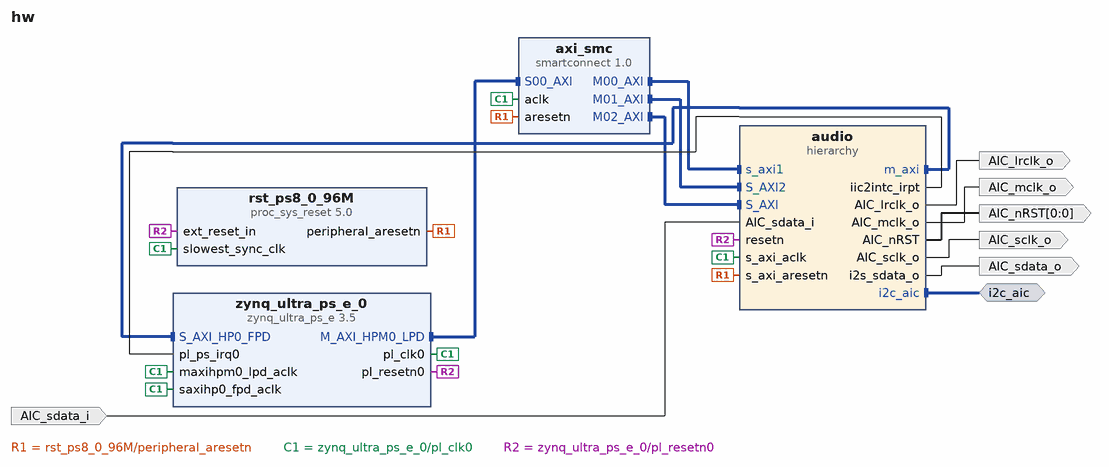
[diagram p0: block diagram of the top level]
# Vivado block design hw, xczu3eg-sfvc784-2-e, Vivado 2025.2
create_bd_design hw

create_bd_intf_port -mode Master -vlnv xilinx.com:interface:iic_rtl:1.0 i2c_aic
create_bd_port -dir O -from 0 -to 0 AIC_nRST
create_bd_port -dir O -type clk AIC_mclk_o
create_bd_port -dir I AIC_sdata_i
create_bd_port -dir O AIC_lrclk_o
create_bd_port -dir O AIC_sclk_o
create_bd_port -dir O AIC_sdata_o

create_bd_cell -type ip -vlnv xilinx.com:ip:zynq_ultra_ps_e:3.5 zynq_ultra_ps_e_0
set_property -dict [list \
  CONFIG.PSU__DDR_HIGH_ADDRESS_GUI_ENABLE 0 \
  CONFIG.PSU__SAXIGP2__DATA_WIDTH 32 \
  CONFIG.PSU__USE__IRQ0 1 \
  CONFIG.PSU__USE__S_AXI_GP2 1 \
] [get_bd_cells zynq_ultra_ps_e_0]
# 5 more settings of zynq_ultra_ps_e_0 are not shown: defaults, MIO pin electricals, DDR timing, and values the tool derives
create_bd_cell -type ip -vlnv xilinx.com:ip:smartconnect:1.0 axi_smc
set_property -dict {CONFIG.NUM_MI 3 CONFIG.NUM_SI 1} [get_bd_cells axi_smc]
create_bd_cell -type ip -vlnv xilinx.com:ip:proc_sys_reset:5.0 rst_ps8_0_96M
create_bd_cell -type hier audio

# ---- hierarchy /audio ----
current_bd_instance /audio
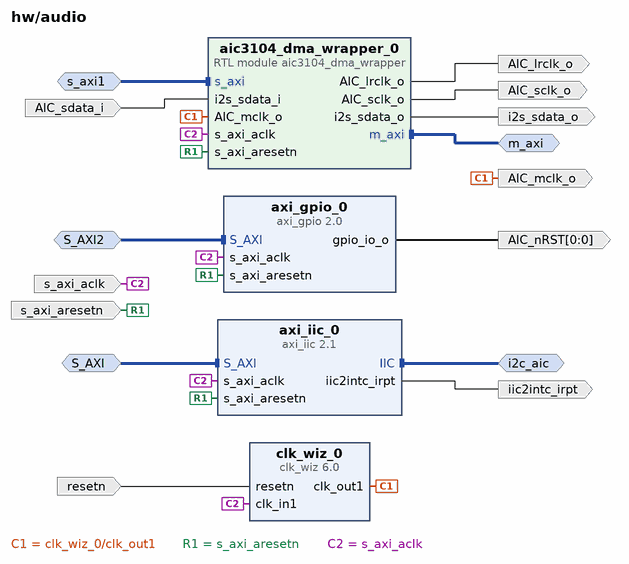
[diagram p1: block diagram inside /audio]
create_bd_intf_pin -mode Slave -vlnv xilinx.com:interface:aximm_rtl:1.0 S_AXI
create_bd_intf_pin -mode Master -vlnv xilinx.com:interface:iic_rtl:1.0 i2c_aic
create_bd_intf_pin -mode Slave -vlnv xilinx.com:interface:aximm_rtl:1.0 s_axi1
create_bd_intf_pin -mode Slave -vlnv xilinx.com:interface:aximm_rtl:1.0 S_AXI2
create_bd_intf_pin -mode Master -vlnv xilinx.com:interface:aximm_rtl:1.0 m_axi
create_bd_pin -dir I -type clk s_axi_aclk
create_bd_pin -dir I -type rst s_axi_aresetn
create_bd_pin -dir O -type intr iic2intc_irpt
create_bd_pin -dir O -type clk AIC_mclk_o
create_bd_pin -dir O AIC_lrclk_o
create_bd_pin -dir O AIC_sclk_o
create_bd_pin -dir I AIC_sdata_i
create_bd_pin -dir O i2s_sdata_o
create_bd_pin -dir O -from 0 -to 0 AIC_nRST
create_bd_pin -dir I -type rst resetn

create_bd_cell -type ip -vlnv xilinx.com:ip:axi_iic:2.1 axi_iic_0
create_bd_cell -type ip -vlnv xilinx.com:ip:axi_gpio:2.0 axi_gpio_0
set_property -dict {CONFIG.C_ALL_OUTPUTS 1 CONFIG.C_GPIO_WIDTH 1} [get_bd_cells axi_gpio_0]
create_bd_cell -type ip -vlnv xilinx.com:ip:clk_wiz:6.0 clk_wiz_0
set_property -dict [list \
  CONFIG.CLKOUT1_JITTER 238.693 \
  CONFIG.CLKOUT1_PHASE_ERROR 160.623 \
  CONFIG.CLKOUT1_REQUESTED_OUT_FREQ 12.288 \
  CONFIG.MMCM_CLKFBOUT_MULT_F 22.875 \
  CONFIG.MMCM_CLKOUT0_DIVIDE_F 90.250 \
  CONFIG.MMCM_DIVCLK_DIVIDE 2 \
  CONFIG.RESET_PORT resetn \
  CONFIG.RESET_TYPE ACTIVE_LOW \
] [get_bd_cells clk_wiz_0]
create_bd_cell -type module -reference aic3104_dma_wrapper aic3104_dma_wrapper_0

# ---- connections ----

current_bd_instance /audio
connect_bd_intf_net [get_bd_intf_pins aic3104_dma_wrapper_0/m_axi] [get_bd_intf_pins m_axi]
connect_bd_intf_net [get_bd_intf_pins i2c_aic] [get_bd_intf_pins axi_iic_0/IIC]
connect_bd_intf_net -intf_net axi_smc_M01_AXI [get_bd_intf_pins S_AXI2] [get_bd_intf_pins axi_gpio_0/S_AXI]
connect_bd_intf_net -intf_net axi_smc_M02_AXI [get_bd_intf_pins S_AXI] [get_bd_intf_pins axi_iic_0/S_AXI]
connect_bd_intf_net -intf_net s_axi1_1 [get_bd_intf_pins s_axi1] [get_bd_intf_pins aic3104_dma_wrapper_0/s_axi]
connect_bd_net [get_bd_pins aic3104_dma_wrapper_0/AIC_lrclk_o] [get_bd_pins AIC_lrclk_o]
connect_bd_net [get_bd_pins aic3104_dma_wrapper_0/AIC_sclk_o] [get_bd_pins AIC_sclk_o]
connect_bd_net [get_bd_pins aic3104_dma_wrapper_0/i2s_sdata_o] [get_bd_pins i2s_sdata_o]
connect_bd_net [get_bd_pins axi_gpio_0/gpio_io_o] [get_bd_pins AIC_nRST]
connect_bd_net [get_bd_pins axi_iic_0/iic2intc_irpt] [get_bd_pins iic2intc_irpt]
connect_bd_net [get_bd_pins clk_wiz_0/clk_out1] [get_bd_pins AIC_mclk_o] [get_bd_pins aic3104_dma_wrapper_0/AIC_mclk_o]
connect_bd_net -net i2s_sdata_i_0_1 [get_bd_pins AIC_sdata_i] [get_bd_pins aic3104_dma_wrapper_0/i2s_sdata_i]
connect_bd_net -net rst_ps8_0_96M_peripheral_aresetn [get_bd_pins s_axi_aresetn] \
  [get_bd_pins axi_gpio_0/s_axi_aresetn] [get_bd_pins axi_iic_0/s_axi_aresetn] \
  [get_bd_pins aic3104_dma_wrapper_0/s_axi_aresetn]
connect_bd_net -net zynq_ultra_ps_e_0_pl_clk0 [get_bd_pins s_axi_aclk] \
  [get_bd_pins axi_gpio_0/s_axi_aclk] [get_bd_pins clk_wiz_0/clk_in1] [get_bd_pins axi_iic_0/s_axi_aclk] \
  [get_bd_pins aic3104_dma_wrapper_0/s_axi_aclk]
connect_bd_net -net zynq_ultra_ps_e_0_pl_resetn0 [get_bd_pins resetn] [get_bd_pins clk_wiz_0/resetn]

current_bd_instance /
connect_bd_intf_net [get_bd_intf_pins zynq_ultra_ps_e_0/S_AXI_HP0_FPD] [get_bd_intf_pins audio/m_axi]
connect_bd_intf_net -intf_net axi_iic_0_IIC [get_bd_intf_ports i2c_aic] [get_bd_intf_pins audio/i2c_aic]
connect_bd_intf_net [get_bd_intf_pins axi_smc/M00_AXI] [get_bd_intf_pins audio/s_axi1]
connect_bd_intf_net [get_bd_intf_pins axi_smc/M01_AXI] [get_bd_intf_pins audio/S_AXI2]
connect_bd_intf_net [get_bd_intf_pins axi_smc/M02_AXI] [get_bd_intf_pins audio/S_AXI]
connect_bd_intf_net [get_bd_intf_pins zynq_ultra_ps_e_0/M_AXI_HPM0_LPD] [get_bd_intf_pins axi_smc/S00_AXI]
connect_bd_net -net aic3104_poll_wrapper_0_AIC_lrclk_o [get_bd_pins audio/AIC_lrclk_o] [get_bd_ports AIC_lrclk_o]
connect_bd_net -net aic3104_poll_wrapper_0_AIC_sclk_o [get_bd_pins audio/AIC_sclk_o] [get_bd_ports AIC_sclk_o]
connect_bd_net -net aic3104_poll_wrapper_0_i2s_sdata_o [get_bd_pins audio/i2s_sdata_o] [get_bd_ports AIC_sdata_o]
connect_bd_net -net axi_gpio_0_gpio_io_o [get_bd_pins audio/AIC_nRST] [get_bd_ports AIC_nRST]
connect_bd_net -net axi_iic_0_iic2intc_irpt [get_bd_pins audio/iic2intc_irpt] [get_bd_pins zynq_ultra_ps_e_0/pl_ps_irq0]
connect_bd_net -net clk_wiz_0_clk_out1 [get_bd_pins audio/AIC_mclk_o] [get_bd_ports AIC_mclk_o]
connect_bd_net -net i2s_sdata_i_0_1 [get_bd_ports AIC_sdata_i] [get_bd_pins audio/AIC_sdata_i]
connect_bd_net [get_bd_pins rst_ps8_0_96M/peripheral_aresetn] [get_bd_pins axi_smc/aresetn] [get_bd_pins audio/s_axi_aresetn]
connect_bd_net [get_bd_pins zynq_ultra_ps_e_0/pl_clk0] \
  [get_bd_pins zynq_ultra_ps_e_0/maxihpm0_lpd_aclk] [get_bd_pins axi_smc/aclk] [get_bd_pins rst_ps8_0_96M/slowest_sync_clk] \
  [get_bd_pins audio/s_axi_aclk] [get_bd_pins zynq_ultra_ps_e_0/saxihp0_fpd_aclk]
connect_bd_net [get_bd_pins zynq_ultra_ps_e_0/pl_resetn0] [get_bd_pins rst_ps8_0_96M/ext_reset_in] [get_bd_pins audio/resetn]

# ---- address map ----
assign_bd_address -offset 0x0000000000 -range 2G -target_address_space [get_bd_addr_spaces audio/aic3104_dma_wrapper_0/m_axi] [get_bd_addr_segs zynq_ultra_ps_e_0/SAXIGP2/HP0_DDR_LOW]
assign_bd_address -offset 0x00FF000000 -range 16M -target_address_space [get_bd_addr_spaces audio/aic3104_dma_wrapper_0/m_axi] [get_bd_addr_segs zynq_ultra_ps_e_0/SAXIGP2/HP0_LPS_OCM]
assign_bd_address -offset 0x0080000000 -range 4M -target_address_space [get_bd_addr_spaces zynq_ultra_ps_e_0/Data] [get_bd_addr_segs audio/aic3104_dma_wrapper_0/s_axi/reg0]
assign_bd_address -offset 0x0080400000 -range 64K -target_address_space [get_bd_addr_spaces zynq_ultra_ps_e_0/Data] [get_bd_addr_segs audio/axi_gpio_0/S_AXI/Reg]
assign_bd_address -offset 0x0080410000 -range 64K -target_address_space [get_bd_addr_spaces zynq_ultra_ps_e_0/Data] [get_bd_addr_segs audio/axi_iic_0/S_AXI/Reg]

validate_bd_design
save_bd_design
